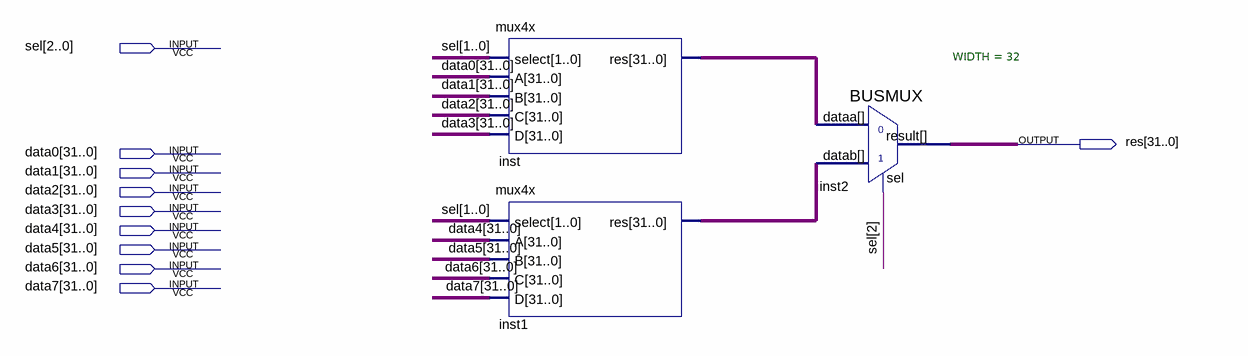
[diagram p0: schematic sheet]
// Quartus schematic mux8x.bdf as structural Verilog: 3 symbols, 10 pins
module mux8x (
  input  [2:0] sel,
  input  [31:0] data0,
  input  [31:0] data1,
  input  [31:0] data2,
  input  [31:0] data3,
  input  [31:0] data4,
  input  [31:0] data5,
  input  [31:0] data6,
  input  [31:0] data7,
  output [31:0] res
);

  wire [31:0] inst1_res, inst_res;

  mux4x inst (.select(sel[1:0]), .A(data0), .B(data1), .C(data2), .D(data3), .res(inst_res));
  mux4x inst1 (.select(sel[1:0]), .A(data4), .B(data5), .C(data6), .D(data7), .res(inst1_res));
  BUSMUX #(.WIDTH(32)) inst2 (.datab(inst1_res), .sel(sel[2]), .dataa(inst_res), .result(res));
endmodule
